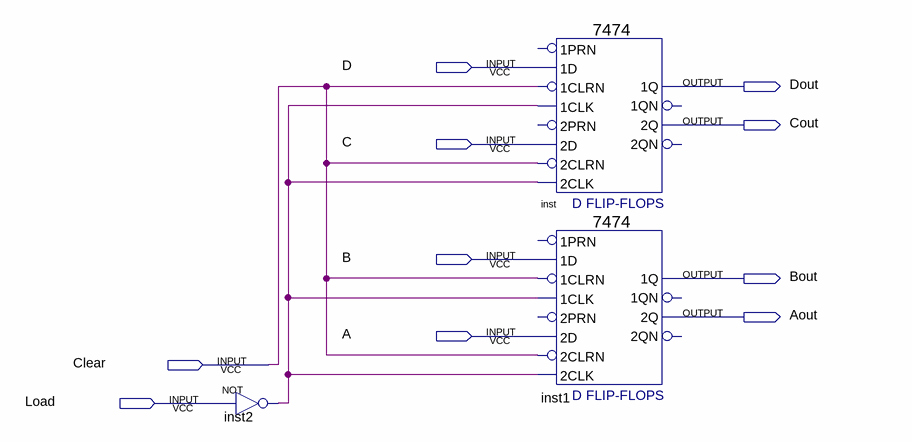
[diagram p0: schematic sheet]
// Quartus schematic RegisterPIPO.bdf as structural Verilog: 3 symbols, 10 pins
module RegisterPIPO (
  input  D,
  input  C,
  input  B,
  input  A,
  input  Clear,
  input  Load,
  output Dout,
  output Cout,
  output Bout,
  output Aout
);

  wire inst2_out;

  not inst2 (inst2_out, Load);
  \7474  inst (
    .\2D (C), .\1CLK (inst2_out), .\1D (D), .\2CLK (inst2_out), .\2CLRN (Clear), .\1CLRN (Clear),
    .\2Q (Cout), .\1Q (Dout));  // open: 2PRN, 1PRN, 1QN, 2QN
  \7474  inst1 (
    .\2D (A), .\1CLK (inst2_out), .\1D (B), .\2CLK (inst2_out), .\2CLRN (Clear), .\1CLRN (Clear),
    .\2Q (Aout), .\1Q (Bout));  // open: 2PRN, 1PRN, 1QN, 2QN
endmodule
